# Altium schematic sheet 01_POWER.SchDoc
size A4; SheetNumber: 1; SheetTotal: 2
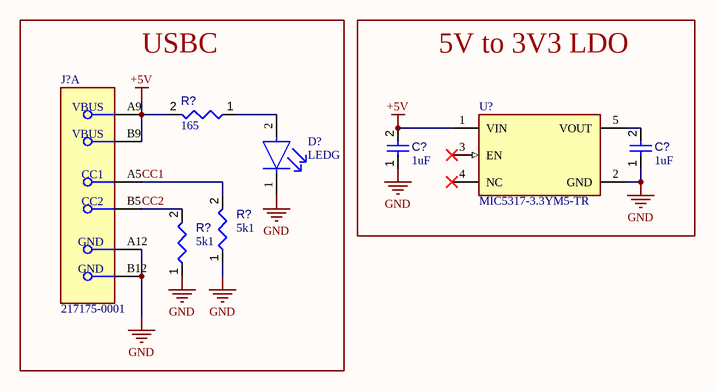
[diagram p0: 01_POWER.SchDoc]

## Parts
(Parts that share a designator on the sheet are numbered #1, #2 ... from top to bottom, then left to right.)
C?#1  value 1uF  [CAPC2013X95X50LL10T25]  (hidden comment: Capacitor 100 nF +/-10% 50 V 0805)
C?#2  value 1uF  [CAPC2013X95X50LL10T25]  (hidden comment: Capacitor 100 nF +/-10% 50 V 0805)
D?  LEDG  [FP-LTST-C170GKT-MFG]
J?  217175-0001  [FP-217175-0001-MFG]  (part A of 2)
R?#1  value 165  [RESC0805(2012)_L]  (hidden comment: Resistor 1K +/-5% 0805 125 mW)
R?#2  value 5k1  [RESC0805(2012)_L]  (hidden comment: Resistor 1K +/-5% 0805 125 mW)
R?#3  value 5k1  [RESC0805(2012)_L]  (hidden comment: Resistor 1K +/-5% 0805 125 mW)
U?  MIC5317-3.3YM5-TR  [FP-SOT23-5LD-PL-1-MFG]

## Blocks framed on the sheet
USBC: D? J? R?#1-R?#3
5V to 3V3 LDO: C?#1 C?#2 U?

## Nets
+5V: C?#1.2 J?.A9(VBUS) J?.B9(VBUS) R?#1.2 U?.1(VIN)
GND: C?#1.1 C?#2.1 D?.1(C) J?.A12(GND) J?.B12(GND) R?#2.1 R?#3.1 U?.2(GND)
CC1: J?.A5(CC1) R?#2.2
CC2: J?.B5(CC2) R?#3.2
NetC?#2_2: C?#2.2 U?.5(VOUT)
NetD?_2: D?.2(A) R?#1.1

Not connected (* = marked no-connect by the designer): U? 3(EN)* 4(NC)*

## Library data of the parts
C?#1 C?#2 = CMP-001-00018-6: Chip Capacitor, 1 uF, +/- 10%, 10 V, 0805 (2012 Metric); Capacitor Type: Ceramic; Voltage Rating: 50V; Pins: 2; Max Operating Temperature: 125°C; Min Operating Temperature: -55°C; Mounting Technology: SM; Case/Package: 0805; RoHS Compliant: True; Tolerance: 10%
D? = CMP-1674-00002-6: LED GREEN CLEAR SMD, 120 mA, 2.6V; Dominant Wavelength: 569nm; Lens Style: Diffused; Forward Voltage: 2.1V; Number of Elements: 1; Wavelength: 565nm; Luminous Intensity: 6mcd; Test Current: 10mA; Power Dissipation: 100mW; Reverse Voltage: 5V; Forward Current: 30mA; Viewing Angle: 130°; Lens Color: Colorless; Min Operating Temperature: -55°C; Number of Pins: 2; Max Operating Temperature: 85°C; Color: Green; Radiation Hardening: No; Illumination Color: Green; Case Code (Metric): 2012; Lens Transparency: Clear; Case/Package: 0805; Width: 1.25mm; Case Code (Imperial): 0805; Package Quantity: 1; Height: 1.1mm; Depth: 1.25mm; Length: 2mm; Power Rating: 100mW; Lead Free: Lead Free; Number of LEDs: 1; Packaging: Tape and Reel; Mount: Surface Mount; Voltage: 5V
J? = CMP-04767-000026-1: CONN RCP USB2.0 C 6+18P SMD RA
R?#1 = CMP-009-00118-3: Chip Resistor, 165 Ohms, +/-5%, 125 mW, -55 to 155 degC, 0805; Tolerance: 5%; Power: 125mW; Case/Package: 0805; Pins: 2; Min Operating Temperature: -55°C; Max Operating Temperature: 155°C
R?#2 R?#3 = CMP-009-00118-3: Chip Resistor, 5.1 kOhms, +/-5%, 125 mW, -55 to 155 degC, 0805; Tolerance: 5%; Power: 125mW; Case/Package: 0805; Pins: 2; Min Operating Temperature: -55°C; Max Operating Temperature: 155°C
U? = CMP-06324-000116-1: IC REG LINEAR 3.3V 150MA SOT23-5; Max Input Voltage: 6V; Number of Regulators: 1; Min Current Limit: 200mA; Dropout Voltage: 155mV; Min Input Voltage: 2.5V; Power Supply Rejection Ratio (PSRR): 70dB; Case/Package: SOT-23-5; Output Voltage: 3.3V; Series: -; Max Operating Temperature: 125°C; Package Quantity: 3000; Mount: Surface Mount; Packaging: Tape and Reel; RoHS Compliant: No; Output Current: 150mA; Min Operating Temperature: -40°C; Number of Outputs: 1